# EAGLE schematic schematic_v1 (EAGLE 7.7.0)
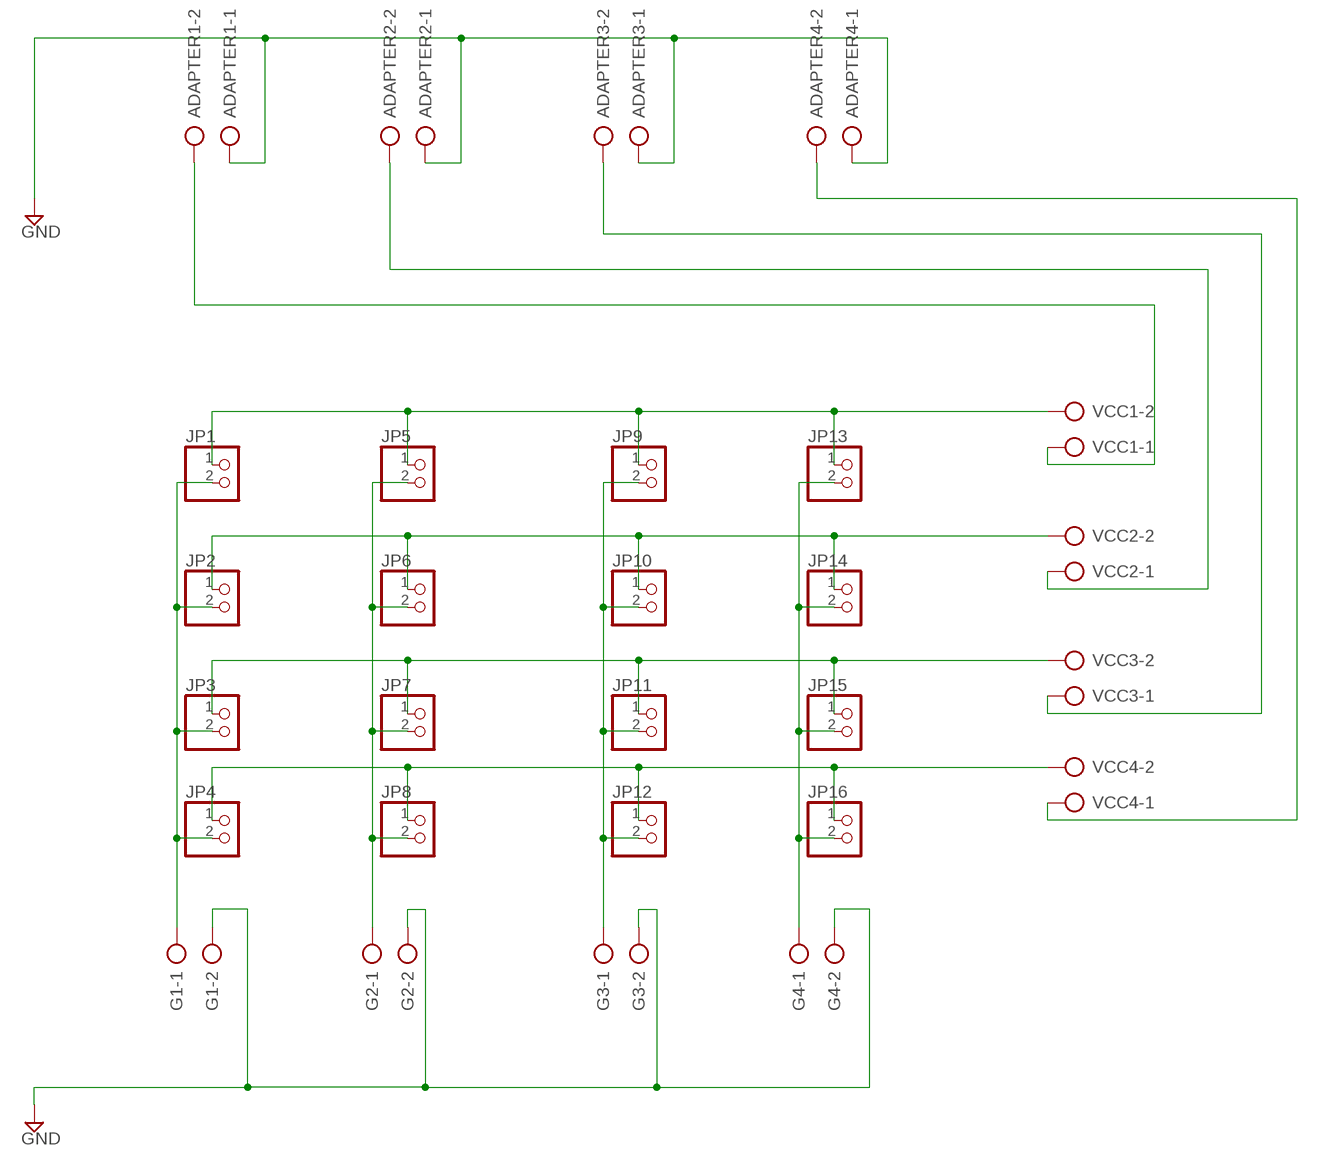
[diagram p0: schematic, sheet 1]

## Parts
ADAPTER1  AK300/2  [AK300/2]
ADAPTER2  AK300/2  [AK300/2]
ADAPTER3  AK300/2  [AK300/2]
ADAPTER4  AK300/2  [AK300/2]
G1  AK300/2  [AK300/2]
G2  AK300/2  [AK300/2]
G3  AK300/2  [AK300/2]
G4  AK300/2  [AK300/2]
JP1  PINHD-1X2  [1X02]
JP2  PINHD-1X2  [1X02]
JP3  PINHD-1X2  [1X02]
JP4  PINHD-1X2  [1X02]
JP5  PINHD-1X2  [1X02]
JP6  PINHD-1X2  [1X02]
JP7  PINHD-1X2  [1X02]
JP8  PINHD-1X2  [1X02]
JP9  PINHD-1X2  [1X02]
JP10  PINHD-1X2  [1X02]
JP11  PINHD-1X2  [1X02]
JP12  PINHD-1X2  [1X02]
JP13  PINHD-1X2  [1X02]
JP14  PINHD-1X2  [1X02]
JP15  PINHD-1X2  [1X02]
JP16  PINHD-1X2  [1X02]
VCC1  AK300/2  [AK300/2]
VCC2  AK300/2  [AK300/2]
VCC3  AK300/2  [AK300/2]
VCC4  AK300/2  [AK300/2]

## Nets
GND: ADAPTER1.1 ADAPTER2.1 ADAPTER3.1 ADAPTER4.1 G1.2 G2.2 G3.2 G4.2
N$1: JP1.1 JP5.1 JP9.1 JP13.1 VCC1.2
N$2: JP2.1 JP6.1 JP10.1 JP14.1 VCC2.2
N$3: JP3.1 JP7.1 JP11.1 JP15.1 VCC3.2
N$4: JP4.1 JP8.1 JP12.1 JP16.1 VCC4.2
N$5: ADAPTER1.2 VCC1.1
N$6: ADAPTER4.2 VCC4.1
N$7: G1.1 JP1.2 JP2.2 JP3.2 JP4.2
N$8: G2.1 JP5.2 JP6.2 JP7.2 JP8.2
N$9: G3.1 JP9.2 JP10.2 JP11.2 JP12.2
N$10: G4.1 JP13.2 JP14.2 JP15.2 JP16.2
N$11: ADAPTER3.2 VCC3.1
N$12: ADAPTER2.2 VCC2.1

## Library data of the parts
ADAPTER1-ADAPTER4 G1-G4 VCC1-VCC4 = con-ptr500:AK300/2: CONNECTOR; OC_FARNELL: unknown; OC_NEWARK: unknown
JP1-JP16 = pinhead:PINHD-1X2: PIN HEADER